# Altium schematic sheet processor.SchDoc
size A4; Revision: 1; SheetNumber: 4; SheetTotal: 5
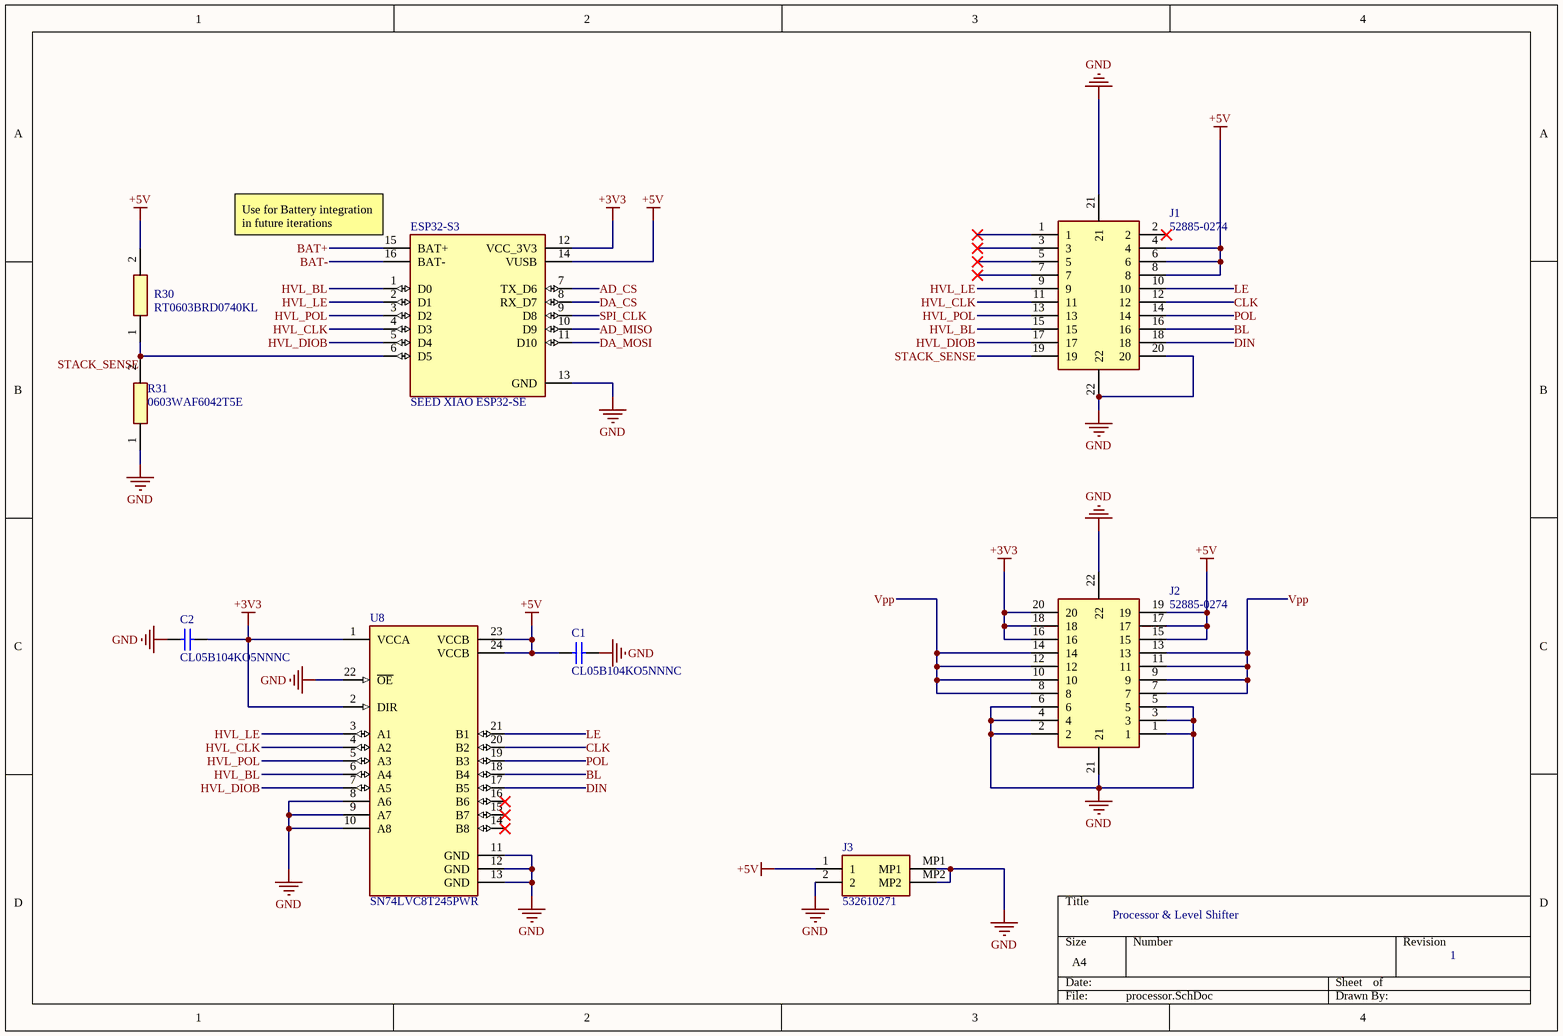
[diagram p0: processor.SchDoc]

## Parts
C1  CL05B104KO5NNNC  [CAPC1050X55X23ML05T13]
C2  CL05B104KO5NNNC  [CAPC1050X55X23ML05T13]
ESP32-S3  SEED XIAO ESP32-SE  [PCBComponent_1]
J1  52885-0274  [528850274]
J2  52885-0274  [528850274]
J3  532610271  [532610271]
R30  RT0603BRD0740KL  [RESC1608X55N]
R31  0603WAF6042T5E  [RESC1608X55N]
U8  SN74LVC8T245PWR  [FP-PW0024A-MFG]

## Nets
+3V3: C2.2 ESP32-S3.12(VCC_3V3) J2.16 J2.18 J2.20 U8.1(VCCA) U8.2(DIR)
+5V: C1.1 ESP32-S3.14(VUSB) J1.4 J1.6 J1.8 J2.15 J2.17 J2.19 J3.1 R30.2 U8.23(VCCB) U8.24(VCCB)
GND: C1.2 C2.1 ESP32-S3.13(GND) J1.20 J1.21 J1.22 J2.1 J2.2 J2.3 J2.4 J2.5 J2.6 J2.21 J2.22 J3.2 J3.MP1 J3.MP2 R31.1 U8.8(A6) U8.9(A7) U8.10(A8) U8.11(GND) U8.12(GND) U8.13(GND) U8.22(~{OE})
AD_CS: ESP32-S3.7(TX_D6)
AD_MISO: ESP32-S3.10(D9)
BAT+: ESP32-S3.15(BAT+)
BAT-: ESP32-S3.16(BAT-)
BL: J1.16 U8.18(B4)
CLK: J1.12 U8.20(B2)
DA_CS: ESP32-S3.8(RX_D7)
DA_MOSI: ESP32-S3.11(D10)
DIN: J1.18 U8.17(B5)
HVL_BL: ESP32-S3.1(D0) J1.15 U8.6(A4)
HVL_CLK: ESP32-S3.4(D3) J1.11 U8.4(A2)
HVL_DIOB: ESP32-S3.5(D4) J1.17 U8.7(A5)
HVL_LE: ESP32-S3.2(D1) J1.9 U8.3(A1)
HVL_POL: ESP32-S3.3(D2) J1.13 U8.5(A3)
LE: J1.10 U8.21(B1)
POL: J1.14 U8.19(B3)
SPI_CLK: ESP32-S3.9(D8)
STACK_SENSE: ESP32-S3.6(D5) J1.19 R30.1 R31.2
Vpp: J2.7 J2.8 J2.9 J2.10 J2.11 J2.12 J2.13 J2.14

Not connected (* = marked no-connect by the designer): J1 1* 2* 3* 5* 7*; U8 14(B8)* 15(B7)* 16(B6)*

## Notes on the sheet
- (near ESP32-S3) Use for Battery integration in future iterations
- Processor & Level Shifter

## Library data of the parts
C1 C2 = CMP-2000-05439-1: Chip Capacitor, 100 nF, +/- 10%, 16 V, -55 to 125 degC, 0402 (1005 Metric), RoHS, Tape and Reel; Manufacturer: Samsung Electro-Mechanics; Capacitance: 100000pF; Dielectric: X7R; Rated Voltage: 16V; Case Size/Dimension: 0402; Tolerance (%): ±10%; Manufacturer URL: http://www.samsungsem.com/global/index.jsp; Datasheet URL: https://datasheet.ciiva.com/29198/458718-da-01-en-vs-kondensator-0402-29198423.pdf; Datasheet Version: Nov-10
ESP32-S3 = Component_1
J1 J2 = 52885-0274: Connector; Manufacturer_Name: Molex; Datasheet Link: https://www.molex.com/webdocs/datasheets/pdf/en-us/0528850274_PCB_RECEPTACLES.pdf; Height: 4mm; Manufacturer_Part_Number: 52885-0274; Mouser Part Number: 538-52885-0274; Mouser Price/Stock: https://www.mouser.co.uk/ProductDetail/Molex/52885-0274?qs=%252BPJ3Ll1xQNYiQig4hWY5jQ%3D%3D
J3 = 53261-0271: C177225; Manufacturer_Name: Molex; Datasheet Link: https://www.molex.com/pdm_docs/sd/532610271_sd.pdf; Height: 3.65mm; Manufacturer_Part_Number: 53261-0271; Mouser Part Number: 538-53261-0271; Mouser Price/Stock: https://www.mouser.co.uk/ProductDetail/Molex/53261-0271?qs=%252B72YyncTwW%252B8%252BBjraxGf3A%3D%3D; Arrow Part Number: 53261-0271; Arrow Price/Stock: https://www.arrow.com/en/products/53261-0271/molex?region=nac
R30 = RT0603BRD0740KL: Resistor; Manufacturer_Name: YAGEO; Datasheet Link: https://www.yageo.com/upload/media/product/app/datasheet/rchip/pyu-rt_1-to-0.01_rohs_l.pdf; Height: 0.55mm; Manufacturer_Part_Number: RT0603BRD0740KL; Mouser Part Number: 603-RT0603BRD0740KL; Mouser Price/Stock: https://www.mouser.co.uk/ProductDetail/YAGEO/RT0603BRD0740KL?qs=gt1LBUVyoHlX7zH8R4KgIw%3D%3D; Arrow Part Number: RT0603BRD0740KL; Arrow Price/Stock: https://www.arrow.com/en/products/rt0603brd0740kl/yageo?region=nac
R31 = MCT06030C6042FP500: Resistor; Manufacturer_Name: Vishay; Datasheet Link: http://www.vishay.com/docs/28705/mcx0x0xpro.pdf; Height: 0.55mm; Manufacturer_Part_Number: 0603WAF6042T5E; Mouser Part Number: 0603WAF6042T5E
U8 = CMP-04899-000027-1: IC TRNSLTR BIDIRECTIONAL 24TSSOP; Manufacturer: Texas Instruments; V B Min: 1.65V; V B Max: 5.5V; Number Of Outputs: 8; Standoff Height: 0.05mm; Nominal Supply Current: 25uA; Number Of Circuits: 1; Propagation Delay: 4.3ns; Logic Function Desc: Non-Inverting; Ambient Temperature Range High: +85°C; Temperature Range Low: -40°C; Category: IC; Min Supply Voltage: 1.65V; Device Class L2: Logic ICs; Digikey Description: IC TRNSLTR BIDIRECTIONAL 24TSSOP; ComponentLink2Description: Datasheet; V A Min: 1.65V; Height: 1.2mm; Device Class L1: Integrated Circuits (ICs); Manufacturer Part Number: SN74LVC8T245PWR; Ipc Land Pattern Name: SOP65P640X120-24; Lead Free: Yes; Device Class L3: Voltage Level Shifters; Octopart: https://octopart.com/sn74lvc8t245pwr-texas+instruments-517164; RoHS: TRUE; Ambient Temperature Range Low: -40°C; Number Of Inputs: 8; Automotive: No; V A Max: 5.5V; Mouser Description: Translation - Voltage Levels 8-Bit Dual-Supply Bus Xcvr; Temperature Range High: +85°C; ComponentLink2URL: http://www.ti.com/lit/ds/symlink/sn74lvc8t245.pdf; Temperature: -40°C to +85°C; Package: PW0024A; Max Supply Voltage: 5.5V